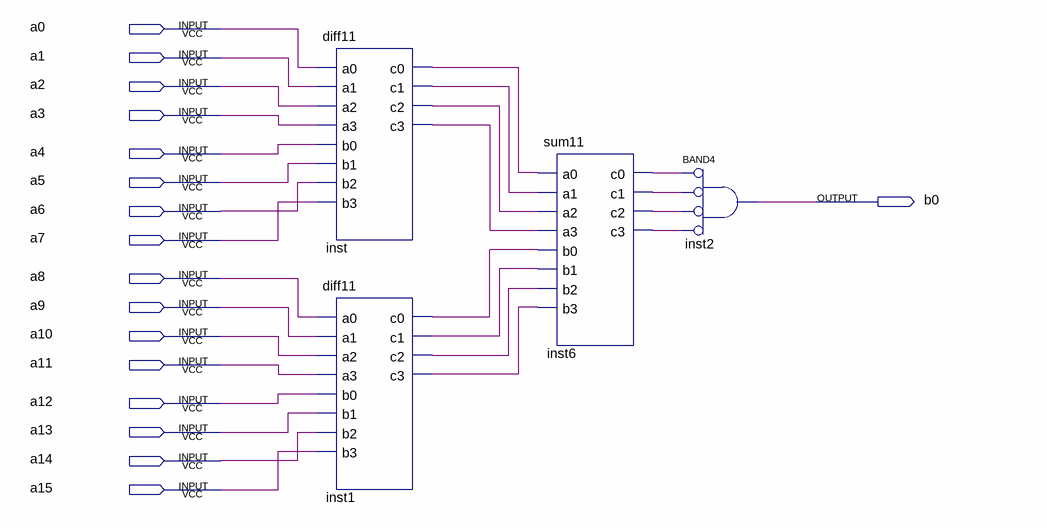
[diagram p0: schematic sheet]
// Quartus schematic LabII.bdf as structural Verilog: 4 symbols, 17 pins
module LabII (
  input  a0,
  input  a1,
  input  a2,
  input  a3,
  input  a4,
  input  a5,
  input  a6,
  input  a7,
  input  a8,
  input  a9,
  input  a10,
  input  a11,
  input  a12,
  input  a13,
  input  a14,
  input  a15,
  output b0
);

  wire inst1_c0, inst1_c1, inst1_c2, inst1_c3, inst6_c0, inst6_c1, inst6_c2, inst6_c3, inst_c0, inst_c1,
       inst_c2, inst_c3;

  diff11 inst (
    .a0(a0), .a1(a1), .a2(a2), .a3(a3), .b0(a4), .b1(a5), .b2(a6), .b3(a7), .c0(inst_c0), .c1(inst_c1),
    .c2(inst_c2), .c3(inst_c3));
  diff11 inst1 (
    .a0(a8), .a1(a9), .a2(a10), .a3(a11), .b0(a12), .b1(a13), .b2(a14), .b3(a15), .c0(inst1_c0),
    .c1(inst1_c1), .c2(inst1_c2), .c3(inst1_c3));
  sum11 inst6 (
    .a0(inst_c0), .a1(inst_c1), .a2(inst_c2), .a3(inst_c3), .b0(inst1_c0), .b1(inst1_c1), .b2(inst1_c2),
    .b3(inst1_c3), .c0(inst6_c0), .c1(inst6_c1), .c2(inst6_c2), .c3(inst6_c3));
  and inst2 (b0, ~inst6_c0, ~inst6_c1, ~inst6_c2, ~inst6_c3);  // BAND4
endmodule
